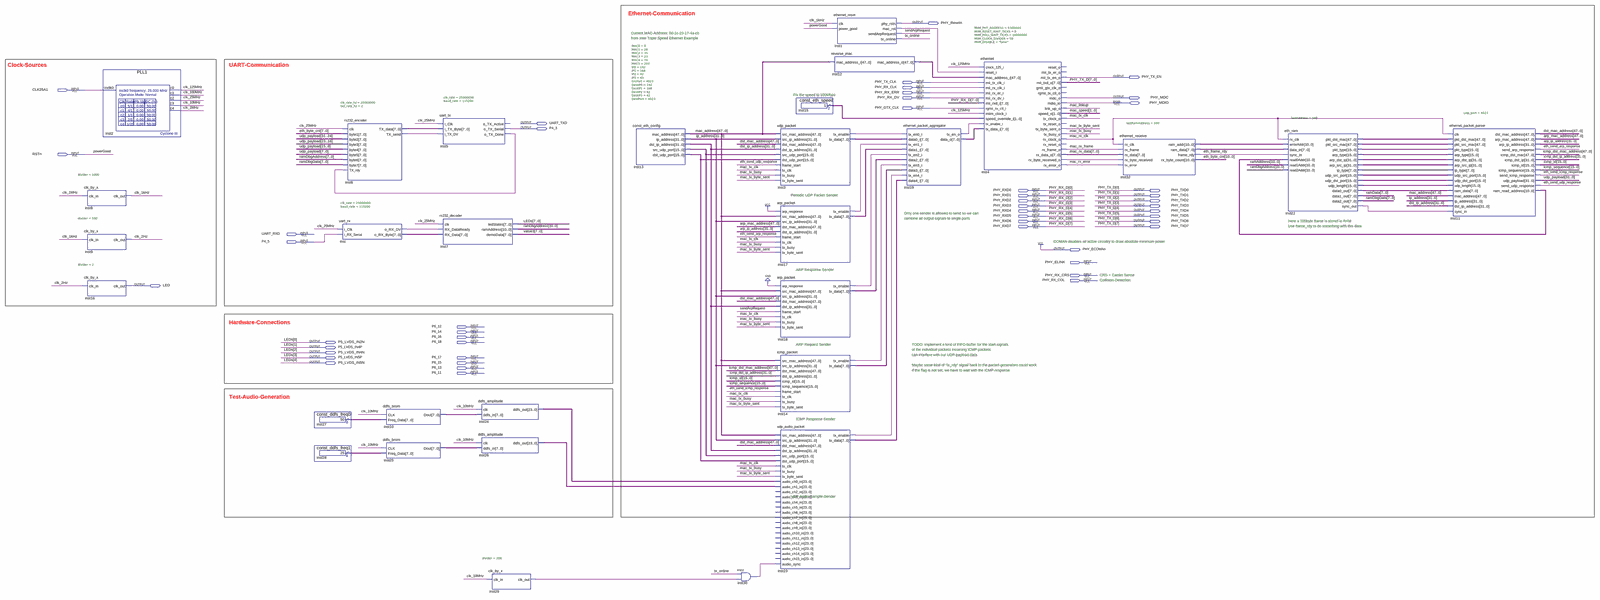
[diagram p0: schematic sheet, whole]
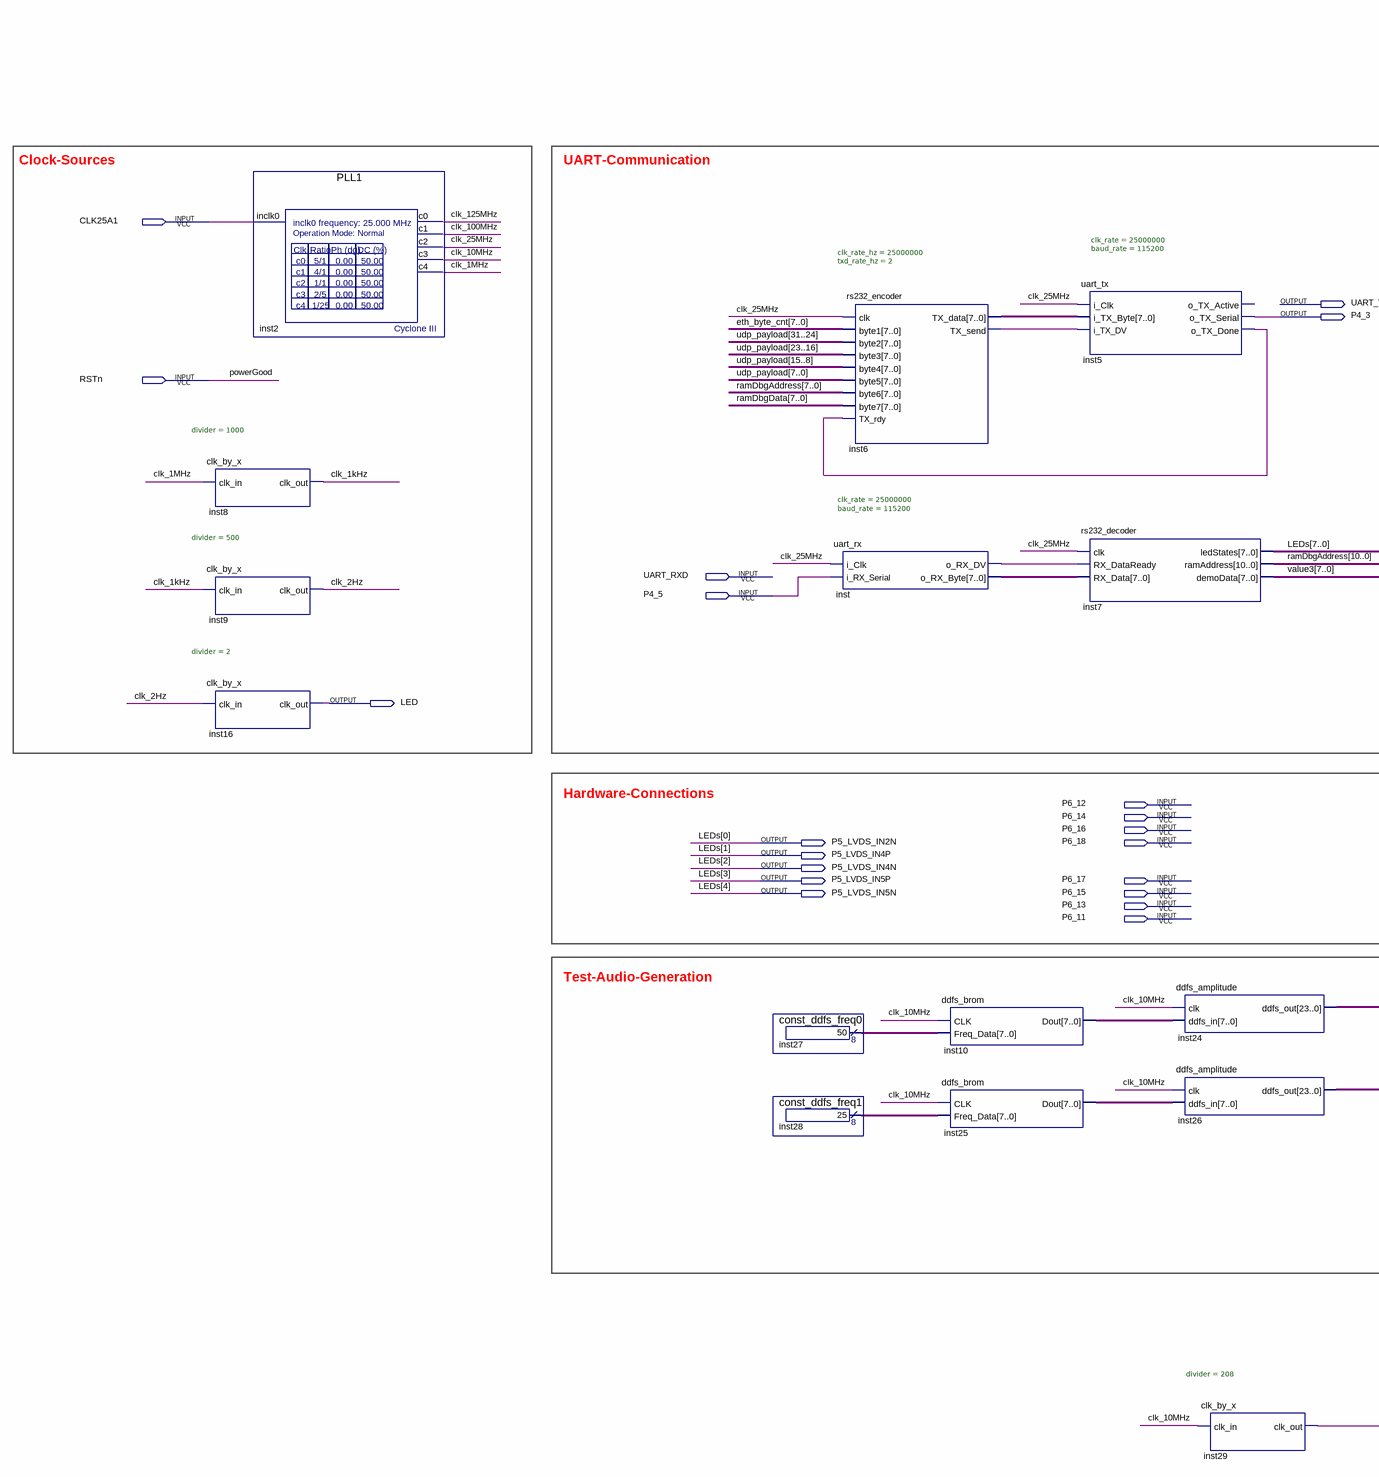
[diagram p1: schematic sheet, left part]
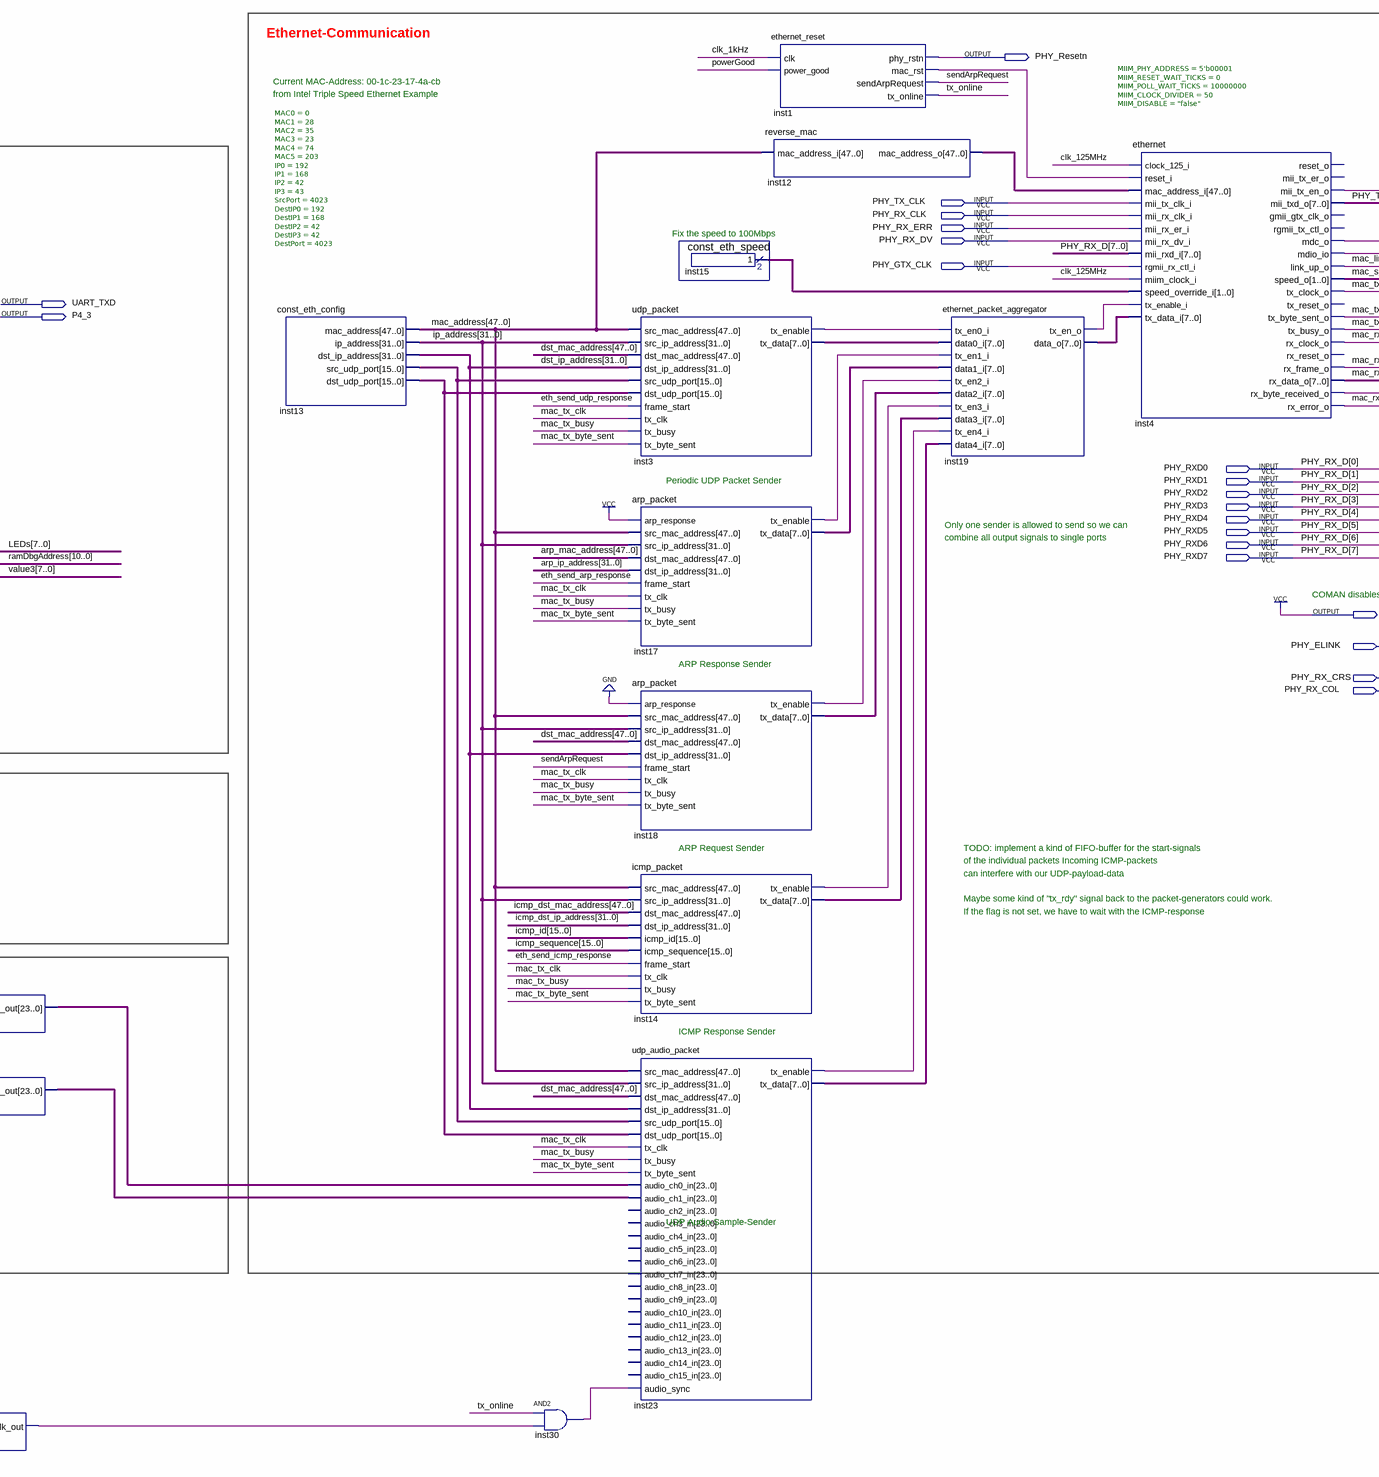
[diagram p2: schematic sheet, centre part]
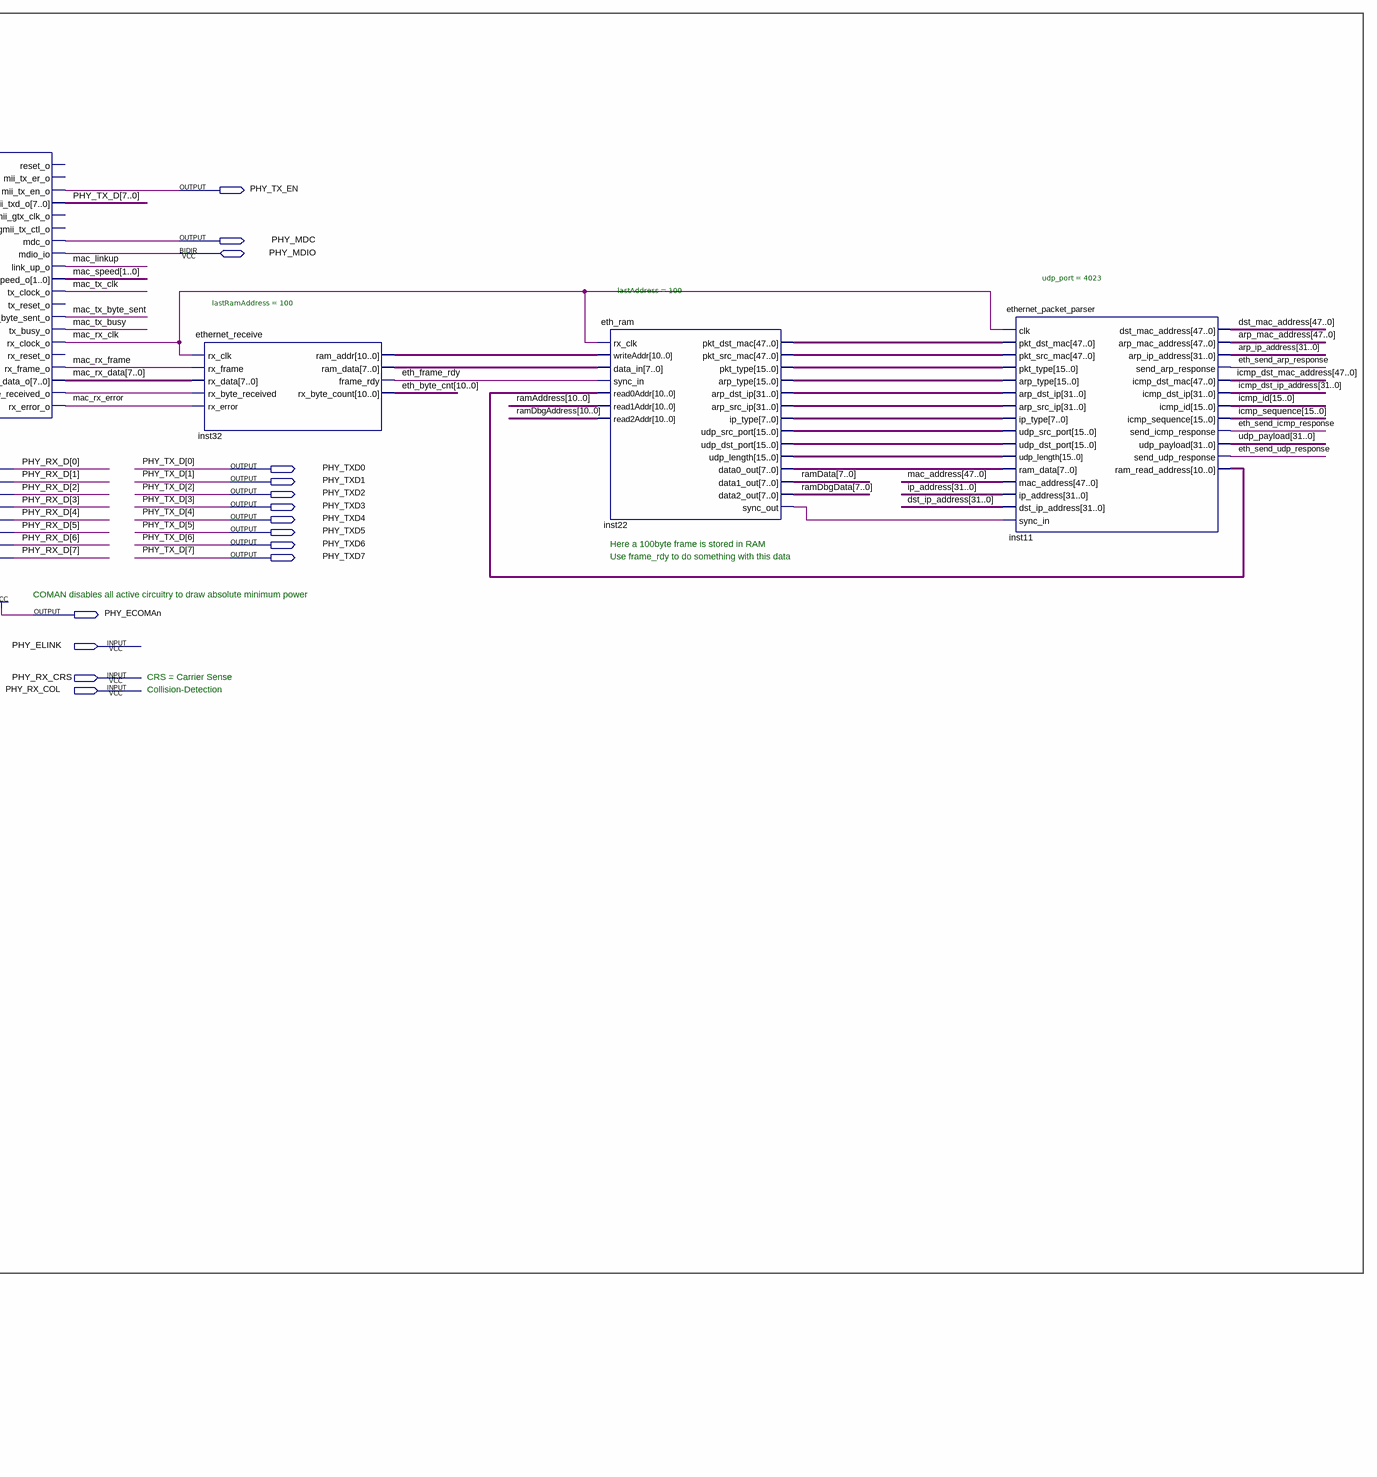
[diagram p3: schematic sheet, right part]
// Quartus schematic FPGA.bdf as structural Verilog: 30 symbols, 49 pins
module FPGA (
  input  PHY_TX_CLK,
  input  PHY_RX_CLK,
  input  CLK25A1,
  input  PHY_RX_ERR,
  input  PHY_RX_DV,
  input  PHY_GTX_CLK,
  input  RSTn,
  input  PHY_RXD0,
  input  PHY_RXD1,
  input  PHY_RXD2,
  input  PHY_RXD3,
  input  PHY_RXD4,
  input  PHY_RXD5,
  input  PHY_RXD6,
  input  PHY_RXD7,
  input  UART_RXD,
  input  P4_5,
  input  PHY_ELINK,
  input  PHY_RX_CRS,
  input  PHY_RX_COL,
  input  P6_12,
  input  P6_14,
  input  P6_16,
  input  P6_18,
  input  P6_17,
  input  P6_15,
  input  P6_13,
  input  P6_11,
  inout  PHY_MDIO,
  output PHY_Resetn,
  output PHY_TX_EN,
  output PHY_MDC,
  output UART_TXD,
  output P4_3,
  output PHY_TXD0,
  output PHY_TXD1,
  output PHY_TXD2,
  output PHY_TXD3,
  output PHY_TXD4,
  output PHY_TXD5,
  output PHY_TXD6,
  output PHY_TXD7,
  output PHY_ECOMAn,
  output LED,
  output P5_LVDS_IN2N,
  output P5_LVDS_IN4P,
  output P5_LVDS_IN4N,
  output P5_LVDS_IN5P,
  output P5_LVDS_IN5N
);

  wire clk_1kHz, clk_1MHz, clk_2Hz, clk_10MHz, clk_25MHz, clk_100MHz, clk_125MHz, eth_frame_rdy,
       eth_send_arp_response, eth_send_icmp_response, eth_send_udp_response, inst1_mac_rst, inst3_tx_enable,
       inst4_rx_byte_received_o, inst5_o_tx_done, inst6_tx_send, inst14_tx_enable, inst17_tx_enable,
       inst18_tx_enable, inst19_tx_en_o, inst22_sync_out, inst23_tx_enable, inst29_clk_out, inst30_out,
       inst_o_rx_dv, mac_linkup, mac_rx_clk, mac_rx_error, mac_rx_frame, mac_tx_busy, mac_tx_byte_sent,
       mac_tx_clk, sendArpRequest, tx_online;
  wire [1:0] inst15_result, mac_speed;
  wire [7:0] inst3_tx_data, inst6_tx_data, inst10_dout, inst14_tx_data, inst17_tx_data, inst18_tx_data,
       inst19_data_o, inst22_data0_out, inst22_ip_type, inst23_tx_data, inst25_dout, inst27_result,
       inst28_result, inst32_ram_data, inst_o_rx_byte, mac_rx_data, ramData, ramDbgData, value3;
  wire [7:5] LEDs;
  wire [10:0] eth_byte_cnt, inst11_ram_read_address, inst32_ram_addr, ramAddress, ramDbgAddress;
  wire [15:0] icmp_id, icmp_sequence, inst13_dst_udp_port, inst13_src_udp_port, inst22_arp_type,
       inst22_pkt_type, inst22_udp_dst_port, inst22_udp_length, inst22_udp_src_port;
  wire [23:0] inst24_ddfs_out, inst26_ddfs_out;
  wire [31:0] arp_ip_address, dst_ip_address, icmp_dst_ip_address, inst22_arp_dst_ip, inst22_arp_src_ip,
       ip_address, udp_payload;
  wire [47:0] arp_mac_address, dst_mac_address, icmp_dst_mac_address, inst12_mac_address_o,
       inst22_pkt_dst_mac, inst22_pkt_src_mac, mac_address;

  clk_by_x #(.divider(1000)) inst8 (.clk_in(clk_1MHz), .clk_out(clk_1kHz));
  clk_by_x #(.divider(500)) inst9 (.clk_in(clk_1kHz), .clk_out(clk_2Hz));
  clk_by_x #(.divider(2)) inst16 (.clk_in(clk_2Hz), .clk_out(LED));
  PLL1 inst2 (.inclk0(CLK25A1), .c0(clk_125MHz), .c1(clk_100MHz), .c2(clk_25MHz), .c3(clk_10MHz), .c4(clk_1MHz));
  const_ddfs_freq0 inst27 (.result(inst27_result));
  const_ddfs_freq1 inst28 (.result(inst28_result));
  rs232_encoder #(.clk_rate_hz(25000000), .txd_rate_hz(2)) inst6 (
    .clk(clk_25MHz), .byte1(eth_byte_cnt[7:0]), .byte2(udp_payload[31:24]), .byte3(udp_payload[23:16]),
    .byte4(udp_payload[15:8]), .byte5(udp_payload[7:0]), .byte6(ramDbgAddress[7:0]), .byte7(ramDbgData),
    .TX_rdy(inst5_o_tx_done), .TX_data(inst6_tx_data), .TX_send(inst6_tx_send));
  uart_rx #(.clk_rate(25000000), .baud_rate(115200)) inst (
    .i_Clk(clk_25MHz), .i_RX_Serial(P4_5), .o_RX_DV(inst_o_rx_dv), .o_RX_Byte(inst_o_rx_byte));
  ddfs_brom inst10 (.CLK(clk_10MHz), .Freq_Data(inst27_result), .Dout(inst10_dout));
  ddfs_brom inst25 (.CLK(clk_10MHz), .Freq_Data(inst28_result), .Dout(inst25_dout));
  uart_tx #(.clk_rate(25000000), .baud_rate(115200)) inst5 (
    .i_Clk(clk_25MHz), .i_TX_Byte(inst6_tx_data), .i_TX_DV(inst6_tx_send), .o_TX_Serial(P4_3),
    .o_TX_Done(inst5_o_tx_done));  // open: o_TX_Active
  rs232_decoder inst7 (
    .clk(clk_25MHz), .RX_DataReady(inst_o_rx_dv), .RX_Data(inst_o_rx_byte),
    .ledStates({LEDs, P5_LVDS_IN5N, P5_LVDS_IN5P, P5_LVDS_IN4N, P5_LVDS_IN4P, P5_LVDS_IN2N}),
    .ramAddress(ramDbgAddress), .demoData(value3));
  ddfs_amplitude inst24 (.clk(clk_10MHz), .ddfs_in(inst10_dout), .ddfs_out(inst24_ddfs_out));
  ddfs_amplitude inst26 (.clk(clk_10MHz), .ddfs_in(inst25_dout), .ddfs_out(inst26_ddfs_out));
  clk_by_x #(.divider(208)) inst29 (.clk_in(clk_10MHz), .clk_out(inst29_clk_out));
  const_eth_config #(.MAC0(0), .MAC1(28), .MAC2(35), .MAC3(23), .MAC4(74), .MAC5(203), .IP0(192), .IP1(168), .IP2(42), .IP3(43), .SrcPort(4023), .DestIP0(192), .DestIP1(168), .DestIP2(42), .DestIP3(42), .DestPort(4023)) inst13 (
    .mac_address(mac_address), .ip_address(ip_address), .dst_ip_address(dst_ip_address),
    .src_udp_port(inst13_src_udp_port), .dst_udp_port(inst13_dst_udp_port));
  and inst30 (inst30_out, tx_online, inst29_clk_out);
  udp_packet inst3 (
    .src_mac_address(mac_address), .src_ip_address(ip_address), .dst_mac_address(dst_mac_address),
    .dst_ip_address(dst_ip_address), .src_udp_port(inst13_src_udp_port), .dst_udp_port(inst13_dst_udp_port),
    .frame_start(eth_send_udp_response), .tx_clk(mac_tx_clk), .tx_busy(mac_tx_busy),
    .tx_byte_sent(mac_tx_byte_sent), .tx_enable(inst3_tx_enable), .tx_data(inst3_tx_data));
  arp_packet inst17 (
    .arp_response(1'b1), .src_mac_address(mac_address), .src_ip_address(ip_address),
    .dst_mac_address(arp_mac_address), .dst_ip_address(arp_ip_address), .frame_start(eth_send_arp_response),
    .tx_clk(mac_tx_clk), .tx_busy(mac_tx_busy), .tx_byte_sent(mac_tx_byte_sent),
    .tx_enable(inst17_tx_enable), .tx_data(inst17_tx_data));
  arp_packet inst18 (
    .arp_response(1'b0), .src_mac_address(mac_address), .src_ip_address(ip_address),
    .dst_mac_address(dst_mac_address), .dst_ip_address(dst_ip_address), .frame_start(sendArpRequest),
    .tx_clk(mac_tx_clk), .tx_busy(mac_tx_busy), .tx_byte_sent(mac_tx_byte_sent),
    .tx_enable(inst18_tx_enable), .tx_data(inst18_tx_data));
  icmp_packet inst14 (
    .src_mac_address(mac_address), .src_ip_address(ip_address), .dst_mac_address(icmp_dst_mac_address),
    .dst_ip_address(icmp_dst_ip_address), .icmp_id(icmp_id), .icmp_sequence(icmp_sequence),
    .frame_start(eth_send_icmp_response), .tx_clk(mac_tx_clk), .tx_busy(mac_tx_busy),
    .tx_byte_sent(mac_tx_byte_sent), .tx_enable(inst14_tx_enable), .tx_data(inst14_tx_data));
  udp_audio_packet inst23 (
    .src_mac_address(mac_address), .src_ip_address(ip_address), .dst_mac_address(dst_mac_address),
    .dst_ip_address(dst_ip_address), .src_udp_port(inst13_src_udp_port), .dst_udp_port(inst13_dst_udp_port),
    .tx_clk(mac_tx_clk), .tx_busy(mac_tx_busy), .tx_byte_sent(mac_tx_byte_sent),
    .audio_ch0_in(inst24_ddfs_out), .audio_ch1_in(inst26_ddfs_out), .audio_sync(inst30_out),
    .tx_enable(inst23_tx_enable), .tx_data(inst23_tx_data));  // open: audio_ch2_in, audio_ch3_in, audio_ch4_in, audio_ch5_in, audio_ch6_in, audio_ch7_in, audio_ch8_in, audio_ch9_in, audio_ch10_in, audio_ch11_in, audio_ch12_in, audio_ch13_in, audio_ch14_in, audio_ch15_in
  const_eth_speed inst15 (.result(inst15_result));
  ethernet_reset inst1 (
    .clk(clk_1kHz), .power_good(RSTn), .phy_rstn(PHY_Resetn), .mac_rst(inst1_mac_rst),
    .sendArpRequest(sendArpRequest), .tx_online(tx_online));
  reverse_mac inst12 (.mac_address_i(mac_address), .mac_address_o(inst12_mac_address_o));
  ethernet_packet_aggregator inst19 (
    .tx_en0_i(inst3_tx_enable), .data0_i(inst3_tx_data), .tx_en1_i(inst17_tx_enable),
    .data1_i(inst17_tx_data), .tx_en2_i(inst18_tx_enable), .data2_i(inst18_tx_data),
    .tx_en3_i(inst14_tx_enable), .data3_i(inst14_tx_data), .tx_en4_i(inst23_tx_enable),
    .data4_i(inst23_tx_data), .tx_en_o(inst19_tx_en_o), .data_o(inst19_data_o));
  ethernet #(.MIIM_PHY_ADDRESS(5'b00001), .MIIM_RESET_WAIT_TICKS(0), .MIIM_POLL_WAIT_TICKS(10000000), .MIIM_CLOCK_DIVIDER(50), .MIIM_DISABLE("false")) inst4 (
    .clock_125_i(clk_125MHz), .reset_i(inst1_mac_rst), .mac_address_i(inst12_mac_address_o),
    .mii_tx_clk_i(PHY_TX_CLK), .mii_rx_clk_i(PHY_RX_CLK), .mii_rx_er_i(PHY_RX_ERR), .mii_rx_dv_i(PHY_RX_DV),
    .mii_rxd_i({PHY_RXD7, PHY_RXD6, PHY_RXD5, PHY_RXD4, PHY_RXD3, PHY_RXD2, PHY_RXD1, PHY_RXD0}),
    .rgmii_rx_ctl_i(PHY_GTX_CLK), .miim_clock_i(clk_125MHz), .speed_override_i(inst15_result),
    .tx_enable_i(inst19_tx_en_o), .tx_data_i(inst19_data_o), .mii_tx_en_o(PHY_TX_EN),
    .mii_txd_o({PHY_TXD7, PHY_TXD6, PHY_TXD5, PHY_TXD4, PHY_TXD3, PHY_TXD2, PHY_TXD1, PHY_TXD0}),
    .mdc_o(PHY_MDC), .link_up_o(mac_linkup), .speed_o(mac_speed), .tx_clock_o(mac_tx_clk),
    .tx_byte_sent_o(mac_tx_byte_sent), .tx_busy_o(mac_tx_busy), .rx_clock_o(mac_rx_clk),
    .rx_frame_o(mac_rx_frame), .rx_data_o(mac_rx_data), .rx_byte_received_o(inst4_rx_byte_received_o),
    .rx_error_o(mac_rx_error), .mdio_io(PHY_MDIO));  // open: reset_o, mii_tx_er_o, gmii_gtx_clk_o, rgmii_tx_ctl_o, tx_reset_o, rx_reset_o
  ethernet_receive #(.lastRamAddress(100)) inst32 (
    .rx_clk(mac_rx_clk), .rx_frame(mac_rx_frame), .rx_data(mac_rx_data),
    .rx_byte_received(inst4_rx_byte_received_o), .rx_error(mac_rx_error), .ram_addr(inst32_ram_addr),
    .ram_data(inst32_ram_data), .frame_rdy(eth_frame_rdy), .rx_byte_count(eth_byte_cnt));
  eth_ram #(.lastAddress(100)) inst22 (
    .rx_clk(mac_rx_clk), .writeAddr(inst32_ram_addr), .data_in(inst32_ram_data), .sync_in(eth_frame_rdy),
    .read0Addr(inst11_ram_read_address), .read1Addr(ramAddress), .read2Addr(ramDbgAddress),
    .pkt_dst_mac(inst22_pkt_dst_mac), .pkt_src_mac(inst22_pkt_src_mac), .pkt_type(inst22_pkt_type),
    .arp_type(inst22_arp_type), .arp_dst_ip(inst22_arp_dst_ip), .arp_src_ip(inst22_arp_src_ip),
    .ip_type(inst22_ip_type), .udp_src_port(inst22_udp_src_port), .udp_dst_port(inst22_udp_dst_port),
    .udp_length(inst22_udp_length), .data0_out(inst22_data0_out), .data1_out(ramData),
    .data2_out(ramDbgData), .sync_out(inst22_sync_out));
  ethernet_packet_parser #(.udp_port(4023)) inst11 (
    .clk(mac_rx_clk), .pkt_dst_mac(inst22_pkt_dst_mac), .pkt_src_mac(inst22_pkt_src_mac),
    .pkt_type(inst22_pkt_type), .arp_type(inst22_arp_type), .arp_dst_ip(inst22_arp_dst_ip),
    .arp_src_ip(inst22_arp_src_ip), .ip_type(inst22_ip_type), .udp_src_port(inst22_udp_src_port),
    .udp_dst_port(inst22_udp_dst_port), .udp_length(inst22_udp_length), .ram_data(inst22_data0_out),
    .mac_address(mac_address), .ip_address(ip_address), .dst_ip_address(dst_ip_address),
    .sync_in(inst22_sync_out), .dst_mac_address(dst_mac_address), .arp_mac_address(arp_mac_address),
    .arp_ip_address(arp_ip_address), .send_arp_response(eth_send_arp_response),
    .icmp_dst_mac(icmp_dst_mac_address), .icmp_dst_ip(icmp_dst_ip_address), .icmp_id(icmp_id),
    .icmp_sequence(icmp_sequence), .send_icmp_response(eth_send_icmp_response), .udp_payload(udp_payload),
    .send_udp_response(eth_send_udp_response), .ram_read_address(inst11_ram_read_address));

  assign PHY_ECOMAn = 1'b1;

  // Other names for the same wires on the sheet: LEDs[4:0] = {P5_LVDS_IN5N, P5_LVDS_IN5P, P5_LVDS_IN4N, P5_LVDS_IN4P, P5_LVDS_IN2N};
  //   PHY_RX_D[7:0] = {PHY_RXD7, PHY_RXD6, PHY_RXD5, PHY_RXD4, PHY_RXD3, PHY_RXD2, PHY_RXD1, PHY_RXD0};
  //   PHY_TX_D[7:0] = {PHY_TXD7, PHY_TXD6, PHY_TXD5, PHY_TXD4, PHY_TXD3, PHY_TXD2, PHY_TXD1, PHY_TXD0};
  //   powerGood = RSTn

  // Notes on the sheet:
  //   Ethernet-Communication
  //   Current MAC-Address: 00-1c-23-17-4a-cb
  //   from Intel Triple Speed Ethernet Example
  //   Clock-Sources
  //   UART-Communication
  //   Fix the speed to 100Mbps
  //   Periodic UDP Packet Sender
  //   Only one sender is allowed to send so we can
  //   combine all output signals to single ports
  //   Here a 100byte frame is stored in RAM
  //   Use frame_rdy to do something with this data
  //   COMAN disables all active circuitry to draw absolute minimum power
  //   ARP Response Sender
  //   CRS = Carrier Sense
  //   Collision-Detection
  //   Hardware-Connections
  //   ARP Request Sender
  //   TODO: implement a kind of FIFO-buffer for the start-signals
  //   of the individual packets Incoming ICMP-packets
  //   can interfere with our UDP-payload-data
  //   Maybe some kind of "tx_rdy" signal back to the packet-generators could work.
  //   If the flag is not set, we have to wait with the ICMP-response
  //   Test-Audio-Generation
  //   ICMP Response Sender
  //   UDP Audio-Sample-Sender
endmodule
